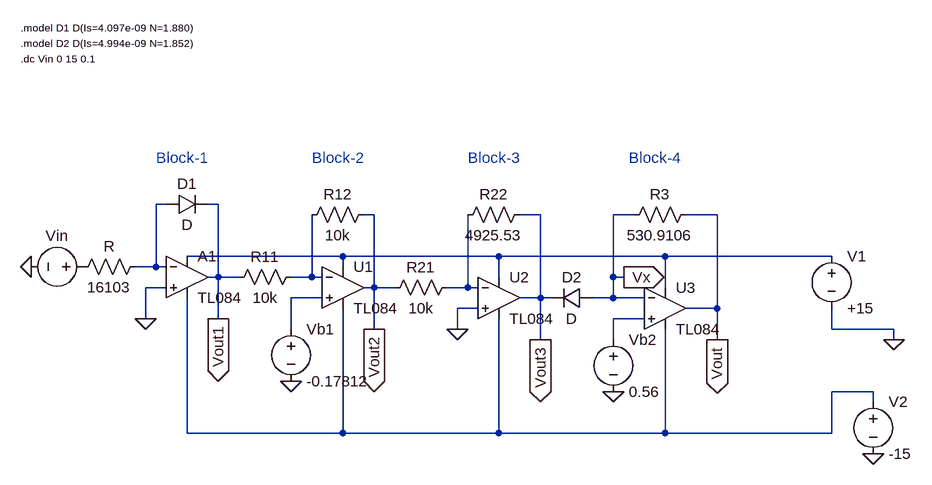
[diagram p0: schematic Log_AntiLog_Amplifier.asc]
Log_AntiLog_Amplifier.asc, the LTspice schematic file:
Version 4
SHEET 1 1156 680
WIRE -176 -112 -192 -112
WIRE -96 -112 -112 -112
WIRE 144 -96 128 -96
WIRE 400 -96 368 -96
WIRE 544 -96 512 -96
WIRE 672 -96 624 -96
WIRE 96 -32 -144 -32
WIRE 336 -32 96 -32
WIRE 592 -32 336 -32
WIRE 848 -32 592 -32
WIRE -192 -16 -192 -112
WIRE -192 -16 -224 -16
WIRE -176 -16 -192 -16
WIRE 96 -16 96 -32
WIRE -96 0 -96 -112
WIRE -96 0 -112 0
WIRE -64 0 -96 0
WIRE 48 0 48 -96
WIRE 48 0 16 0
WIRE 64 0 48 0
WIRE 336 0 336 -32
WIRE 512 0 512 -96
WIRE 528 0 512 0
WIRE -176 16 -208 16
WIRE 144 16 144 -96
WIRE 144 16 128 16
WIRE 176 16 144 16
WIRE 288 16 288 -96
WIRE 288 16 256 16
WIRE 304 16 288 16
WIRE 592 16 592 -32
WIRE 64 32 16 32
WIRE 400 32 400 -96
WIRE 400 32 368 32
WIRE 416 32 400 32
WIRE 512 32 512 0
WIRE 512 32 480 32
WIRE 560 32 512 32
WIRE 304 48 272 48
WIRE 672 48 672 -96
WIRE 672 48 624 48
WIRE -208 64 -208 16
WIRE -96 64 -96 0
WIRE 560 64 512 64
WIRE 16 80 16 32
WIRE 144 80 144 16
WIRE 272 80 272 48
WIRE 848 80 848 48
WIRE 944 80 848 80
WIRE 400 96 400 32
WIRE 512 96 512 64
WIRE 672 96 672 48
WIRE 944 96 944 80
WIRE 912 176 848 176
WIRE 912 192 912 176
WIRE -144 240 -144 32
WIRE 96 240 96 48
WIRE 96 240 -144 240
WIRE 336 240 336 64
WIRE 336 240 96 240
WIRE 592 240 592 80
WIRE 592 240 336 240
WIRE 848 240 848 176
WIRE 848 240 592 240
FLAG -208 64 0
FLAG 272 80 0
FLAG 16 160 0
FLAG 512 176 0
FLAG 944 96 0
FLAG -384 -16 0
FLAG 672 96 Vout
IOPIN 672 96 Out
FLAG 400 96 Vout3
IOPIN 400 96 Out
FLAG 528 0 Vx
IOPIN 528 0 Out
FLAG 144 80 Vout2
IOPIN 144 80 Out
FLAG -96 64 Vout1
IOPIN -96 64 Out
FLAG 912 272 0
SYMBOL TL084\\TL084 -144 0 R0
SYMATTR InstName A1
SYMBOL TL084\\TL084 96 16 R0
SYMATTR InstName U1
SYMBOL TL084\\TL084 336 32 R0
SYMATTR InstName U2
SYMBOL TL084\\TL084 592 48 R0
SYMATTR InstName U3
SYMBOL res -320 0 R270
WINDOW 0 32 56 VTop 2
WINDOW 3 0 56 VBottom 2
SYMATTR InstName R
SYMATTR Value 16103
SYMBOL res 32 -16 R90
WINDOW 0 0 56 VBottom 2
WINDOW 3 32 56 VTop 2
SYMATTR InstName R11
SYMATTR Value 10k
SYMBOL res 144 -112 R90
WINDOW 0 0 56 VBottom 2
WINDOW 3 32 56 VTop 2
SYMATTR InstName R12
SYMATTR Value 10k
SYMBOL res 272 0 R90
WINDOW 0 0 56 VBottom 2
WINDOW 3 32 56 VTop 2
SYMATTR InstName R21
SYMATTR Value 10k
SYMBOL diode -176 -96 R270
WINDOW 0 32 32 VTop 2
WINDOW 3 0 32 VBottom 2
SYMATTR InstName D1
SYMBOL diode 480 16 R90
WINDOW 0 0 32 VBottom 2
WINDOW 3 32 32 VTop 2
SYMATTR InstName D2
SYMBOL res 384 -112 R90
WINDOW 0 0 56 VBottom 2
WINDOW 3 32 56 VTop 2
SYMATTR InstName R22
SYMATTR Value 4925.53
SYMBOL res 640 -112 R90
WINDOW 0 0 56 VBottom 2
WINDOW 3 32 56 VTop 2
SYMATTR InstName R3
SYMATTR Value 530.9106
SYMBOL voltage 16 64 R0
WINDOW 123 0 0 Left 0
WINDOW 39 0 0 Left 0
SYMATTR InstName Vb1
SYMATTR Value -0.17812
SYMBOL voltage 512 80 R0
WINDOW 123 0 0 Left 0
WINDOW 39 0 0 Left 0
SYMATTR InstName Vb2
SYMATTR Value 0.56
SYMBOL voltage 848 -48 R0
WINDOW 123 0 0 Left 0
WINDOW 39 0 0 Left 0
SYMATTR InstName V1
SYMATTR Value +15
SYMBOL voltage 912 176 R0
WINDOW 123 0 0 Left 0
WINDOW 39 0 0 Left 0
SYMATTR InstName V2
SYMATTR Value -15
SYMBOL voltage -288 -16 R90
WINDOW 0 -32 56 VBottom 2
WINDOW 3 32 56 VTop 2
WINDOW 123 0 0 Left 0
WINDOW 39 0 0 Left 0
SYMATTR InstName Vin
SYMATTR Value ""
TEXT -400 -384 Left 1 !.model D1 D(Is=4.097e-09 N=1.880)
TEXT -400 -360 Left 1 !.model D2 D(Is=4.994e-09 N=1.852)
TEXT -192 -184 Left 2 ;Block-1
TEXT 48 -184 Left 2 ;Block-2
TEXT 288 -184 Left 2 ;Block-3
TEXT 536 -184 Left 2 ;Block-4
TEXT -400 -336 Left 1 !.dc Vin 0 15 0.1

The netlist it stands for:
* Log_AntiLog_Amplifier.asc
* A1: TL084 (symbol TL084\TL084 not available, pins judged from their places): In+=0 In-=N001 V+=N002 V-=N007 OUT=Vout1
* U1: TL084 (symbol TL084\TL084 not available, pins judged from their places): In+=N005 In-=N003 V+=N002 V-=N007 OUT=Vout2
* U2: TL084 (symbol TL084\TL084 not available, pins judged from their places): In+=0 In-=N004 V+=N002 V-=N007 OUT=Vout3
* U3: TL084 (symbol TL084\TL084 not available, pins judged from their places): In+=N006 In-=Vx V+=N002 V-=N007 OUT=Vout
R P001 N001 16103
R11 N003 Vout1 10k
R12 Vout2 N003 10k
R21 N004 Vout2 10k
D1 N001 Vout1 D
D2 Vx Vout3 D
R22 Vout3 N004 4925.53
R3 Vout Vx 530.9106
Vb1 N005 0 -0.17812
Vb2 N006 0 0.56
V1 N002 0 +15
V2 N007 0 -15
Vin P001 0
.model D D
.lib standard.dio
.model D1 D(Is=4.097e-09 N=1.880)
.model D2 D(Is=4.994e-09 N=1.852)
* Block-1
* Block-2
* Block-3
* Block-4
.dc Vin 0 15 0.1
.backanno
.end